# Altium schematic sheet 1_MCU.schdoc (part 1 of 2)
size 426 x 304 mm; Symbol: Sheet-Symbol_A3; Device: Sheet-Symbol_A3; Convert to PCB: yes; Add into BOM: yes; Part Number: JLCPCB-001; Drawed: FXC; Reviewed: FXC; Company: 深圳嘉立创科技发展有限公司; @Project Name: 3D打印机控制板 SKR MINI E3V2_精简版; @Page Count: 1; @Update Date: 2022-07-12; @Create Date: 2022-01-04; @Schematic Name: SKR MINI E3V2 SCH; Version: V0.1; Page Size: A3; @Page No: 1
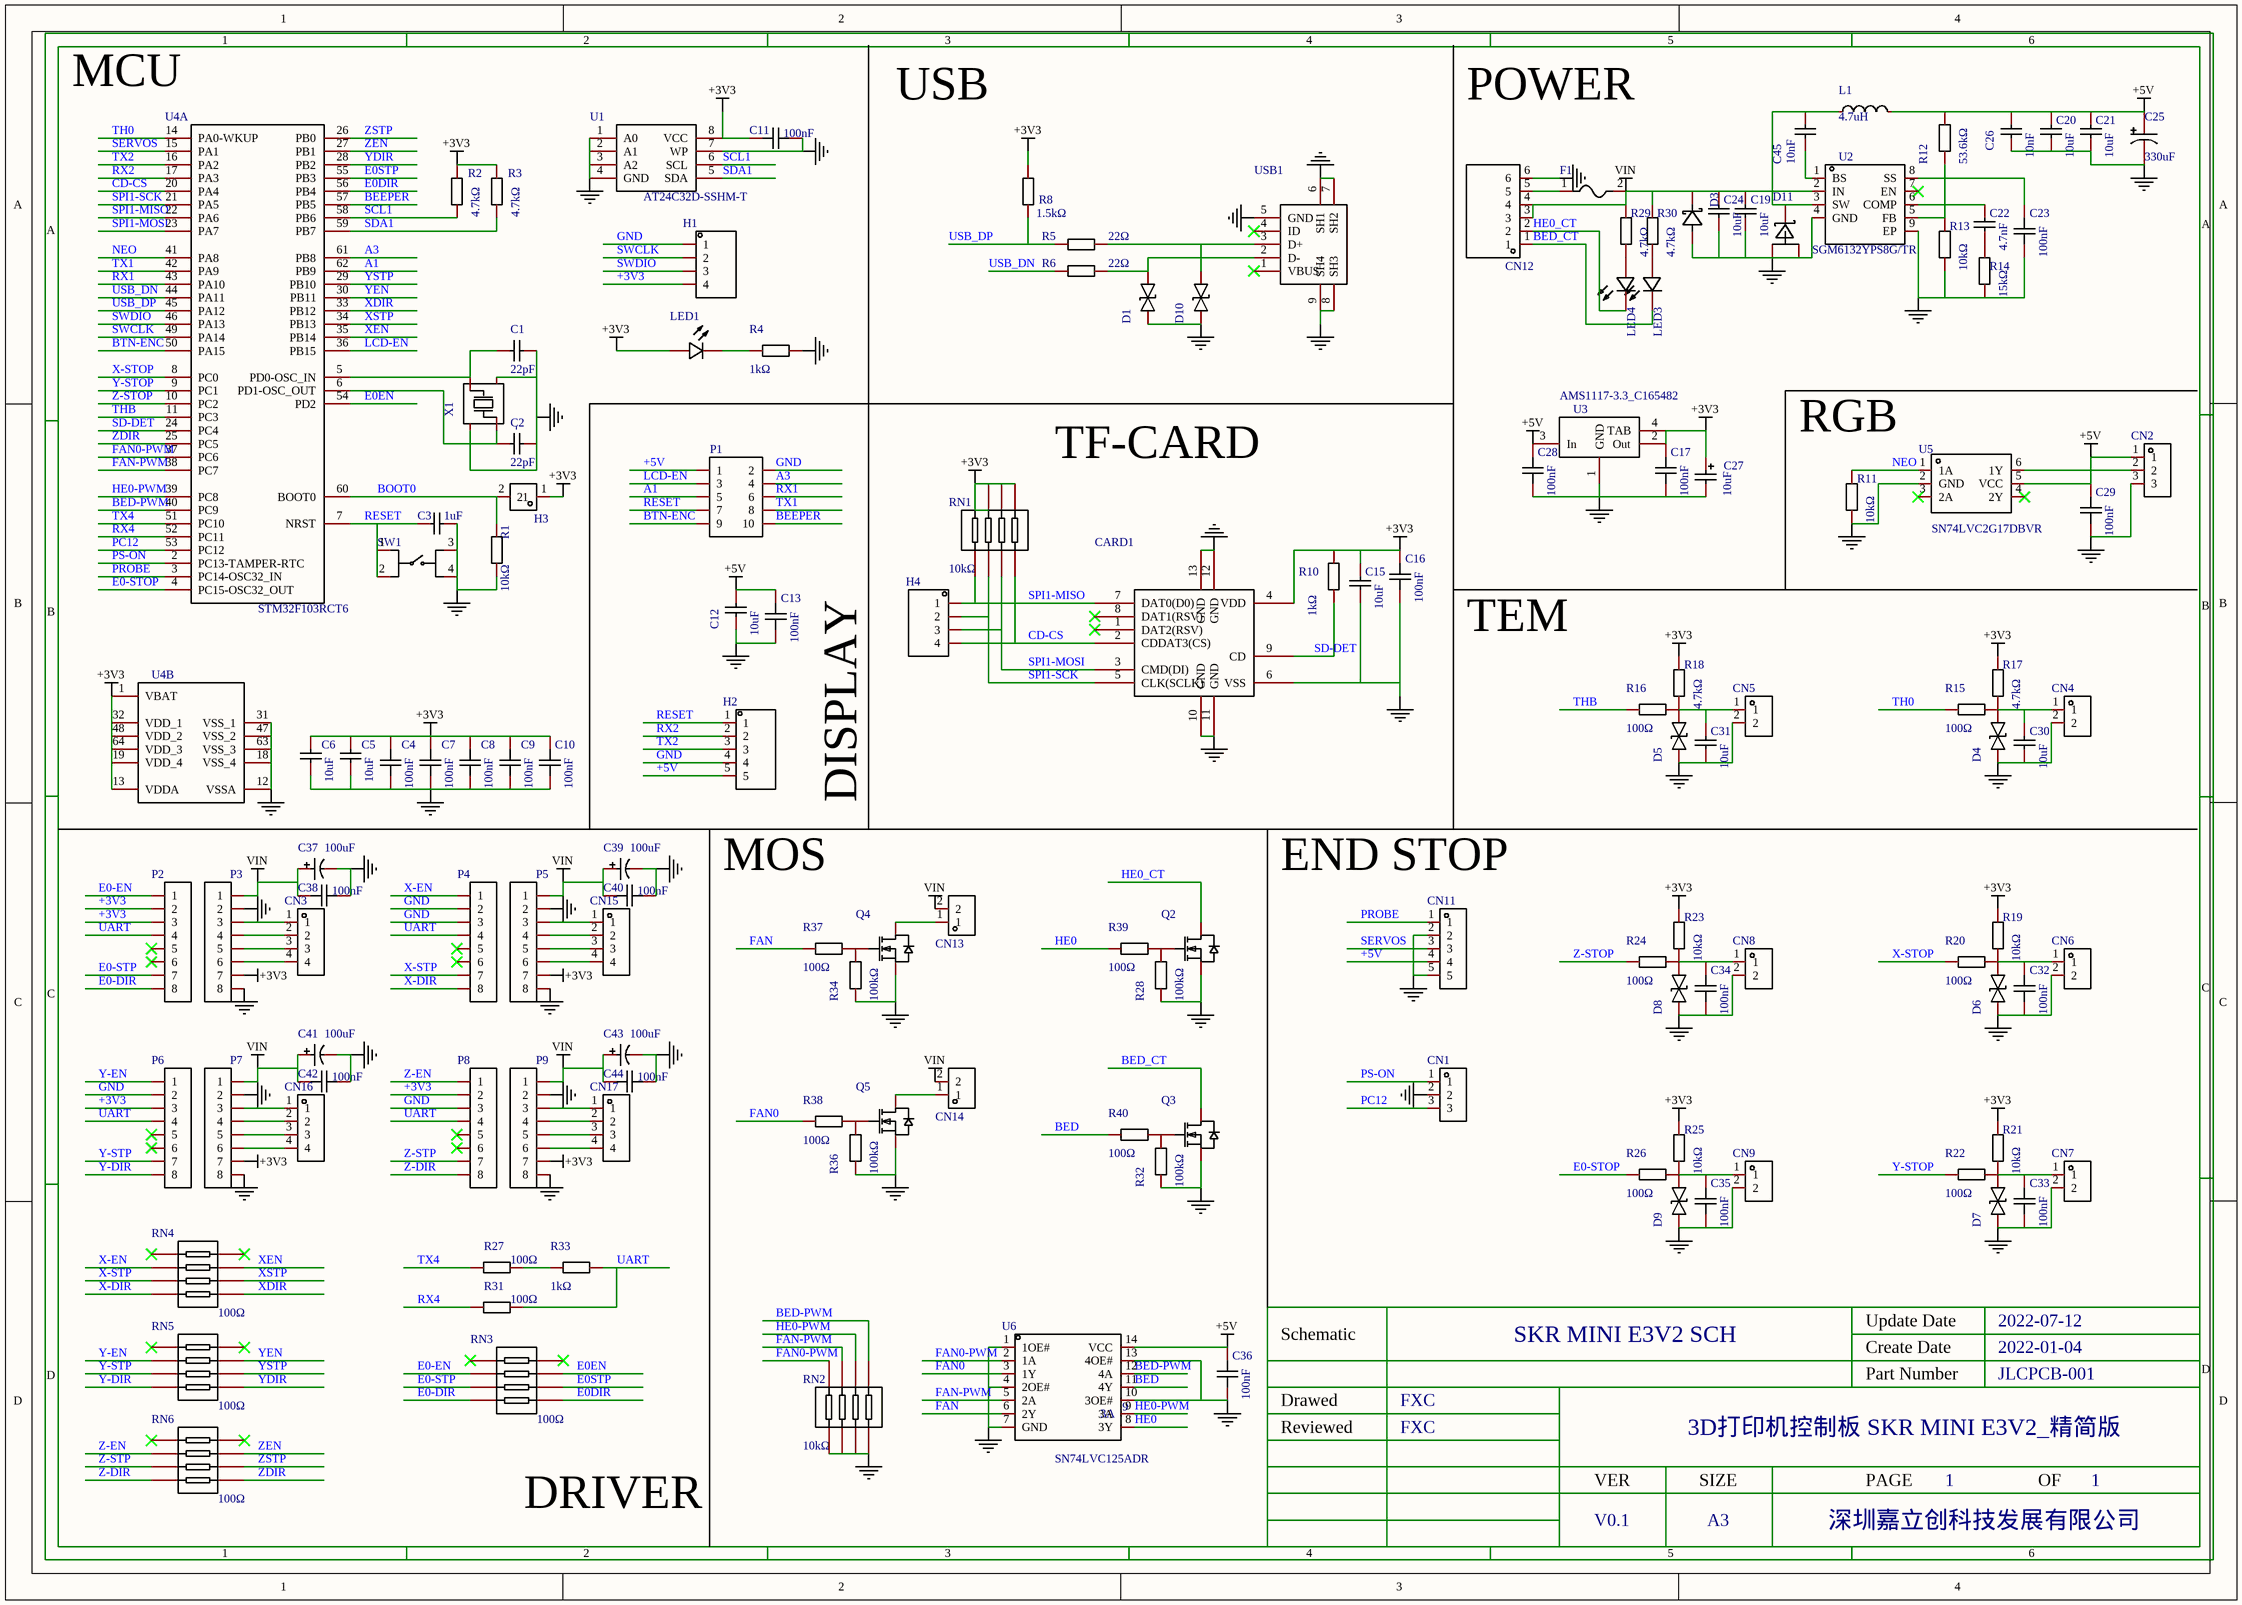
[diagram p0: 1_MCU.schdoc]

## Parts
C1  value 22pF  [C0603]  (hidden comment: CC0603JRNPO9BN220)
C2  value 22pF  [C0603]  (hidden comment: CC0603JRNPO9BN220)
C3  value 1uF  [C0603]  (hidden comment: CC0603KRX5R8BB105)
C4  value 100nF  [C0603]  (hidden comment: CC0603KRX7R9BB104)
C5  value 10uF  [C0603]  (hidden comment: 0603X106K160NT)
C6  value 10uF  [C0603]  (hidden comment: 0603X106K160NT)
C7  value 100nF  [C0603]  (hidden comment: CC0603KRX7R9BB104)
C8  value 100nF  [C0603]  (hidden comment: CC0603KRX7R9BB104)
C9  value 100nF  [C0603]  (hidden comment: CC0603KRX7R9BB104)
C10  value 100nF  [C0603]  (hidden comment: CC0603KRX7R9BB104)
C11  value 100nF  [C0603]  (hidden comment: CC0603KRX7R9BB104)
C12  value 10uF  [C0603]  (hidden comment: 0603X106K160NT)
C13  value 100nF  [C0603]  (hidden comment: CC0603KRX7R9BB104)
C15  value 10uF  [C0603]  (hidden comment: 0603X106K160NT)
C16  value 100nF  [C0603]  (hidden comment: CC0603KRX7R9BB104)
C17  value 100nF  [C0603]  (hidden comment: CC0603KRX7R9BB104)
C19  value 10uF  [C1210]  (hidden comment: GRM32ER71H106KA12L)
C20  value 10uF  [C1210]  (hidden comment: GRM32ER71H106KA12L)
C21  value 10uF  [C1210]  (hidden comment: GRM32ER71H106KA12L)
C22  value 4.7nF  [C0603]  (hidden comment: CC0603KRX7R9BB472)
C23  value 100nF  [C0603]  (hidden comment: CC0603KRX7R9BB104)
C24  value 10uF  [C1210]  (hidden comment: GRM32ER71H106KA12L)
C25  value 330uF  [CAP-SMD_BD8.0-L8.3-W8.3-FD]  (hidden comment: VEJ331M1ETR-0810)
C26  value 10nF  [C0603]  (hidden comment: CC0603KRX7R9BB103)
C27  value 10uF  [CAP-SMD_L3.2-W2.8]  (hidden comment: TAJB106K016RNJ)
C28  value 100nF  [C0603]  (hidden comment: CC0603KRX7R9BB104)
C29  value 100nF  [C0603]  (hidden comment: CC0603KRX7R9BB104)
C30  value 10uF  [C0603]  (hidden comment: 0603X106K160NT)
C31  value 10uF  [C0603]  (hidden comment: 0603X106K160NT)
C32  value 100nF  [C0603]  (hidden comment: CC0603KRX7R9BB104)
C33  value 100nF  [C0603]  (hidden comment: CC0603KRX7R9BB104)
C34  value 100nF  [C0603]  (hidden comment: CC0603KRX7R9BB104)
C35  value 100nF  [C0603]  (hidden comment: CC0603KRX7R9BB104)
C36  value 100nF  [C0603]  (hidden comment: CC0603KRX7R9BB104)
C37  value 100uF  [CAP-SMD_BD6.3-L6.6-W6.6-FD]  (hidden comment: DV101M035E077ETR)
C38  value 100nF  [C0603]  (hidden comment: CC0603KRX7R9BB104)
C39  value 100uF  [CAP-SMD_BD6.3-L6.6-W6.6-FD]  (hidden comment: DV101M035E077ETR)
C40  value 100nF  [C0603]  (hidden comment: CC0603KRX7R9BB104)
C41  value 100uF  [CAP-SMD_BD6.3-L6.6-W6.6-FD]  (hidden comment: DV101M035E077ETR)
C42  value 100nF  [C0603]  (hidden comment: CC0603KRX7R9BB104)
C43  value 100uF  [CAP-SMD_BD6.3-L6.6-W6.6-FD]  (hidden comment: DV101M035E077ETR)
C44  value 100nF  [C0603]  (hidden comment: CC0603KRX7R9BB104)
C45  value 10nF  [C0603]  (hidden comment: CC0603KRX7R9BB103)
CARD1  TF-01A  [TF-SMD_TF-01A]  (value not drawn)
CN1  HX25003-3A  [CONN-TH_3P-P2.50_HX25003-3A]  (value not drawn)
CN2  HX25003-3A  [CONN-TH_3P-P2.50_HX25003-3A]  (value not drawn)
CN3  HX25003-4A  [CONN-TH_4P-P2.50_HX25003-4A]  (value not drawn)
CN4  HX25003-2A  [CONN-TH_2P-P2.50_HX25003-2A]  (value not drawn)
CN5  HX25003-2A  [CONN-TH_2P-P2.50_HX25003-2A]  (value not drawn)
CN6  HX25003-2A  [CONN-TH_2P-P2.50_HX25003-2A]  (value not drawn)
CN7  HX25003-2A  [CONN-TH_2P-P2.50_HX25003-2A]  (value not drawn)
CN8  HX25003-2A  [CONN-TH_2P-P2.50_HX25003-2A]  (value not drawn)
CN9  HX25003-2A  [CONN-TH_2P-P2.50_HX25003-2A]  (value not drawn)
CN11  HX25003-5A  [CONN-TH_5P-P2.50_HX25003-5A]  (value not drawn)
CN12  HB9500M-9.5-6P  [CONN-TH_6P-P9.50_HB9500-9.5-6P]  (value not drawn)
CN13  HX25003-2A  [CONN-TH_2P-P2.50_HX25003-2A]  (value not drawn)
CN14  HX25003-2A  [CONN-TH_2P-P2.50_HX25003-2A]  (value not drawn)
CN15  HX25003-4A  [CONN-TH_4P-P2.50_HX25003-4A]  (value not drawn)
CN16  HX25003-4A  [CONN-TH_4P-P2.50_HX25003-4A]  (value not drawn)
CN17  HX25003-4A  [CONN-TH_4P-P2.50_HX25003-4A]  (value not drawn)
D1  0402ESDA-05N  [D0402]  (value not drawn)
D3  SMCJ24A_C699044  [SMC_L6.9-W5.9-LS7.9-R-RD]  (value not drawn)
D4  0402ESDA-05N  [D0402]  (value not drawn)
D5  0402ESDA-05N  [D0402]  (value not drawn)
D6  0402ESDA-05N  [D0402]  (value not drawn)
D7  0402ESDA-05N  [D0402]  (value not drawn)
D8  0402ESDA-05N  [D0402]  (value not drawn)
D9  0402ESDA-05N  [D0402]  (value not drawn)
D10  0402ESDA-05N  [D0402]  (value not drawn)
D11  SVM1045V  [TO-277B_3P-L6.1-W4.3-LS6.5-BR]  (value not drawn)
F1  JFC2410-1800TS  [F2410]  (value not drawn)
H1  B-2100S04P-A110  [HDR-TH_4P-P2.54-V-M]  (value not drawn)
H2  B-2100S05P-A110  [HDR-TH_5P-P2.54-V-M]  (value not drawn)
H3  PH-00218  [HDR-TH_P2.54-V-M-R1-C2-S2.54]  (value not drawn)
H4  B-2100S04P-A110  [HDR-TH_4P-P2.54-V-M]  (value not drawn)
L1  value 4.7uH  [IND-SMD_L6.0-W6.0_SLF6028T]  (hidden comment: SLO0630H100MTT)
LED1  19-217/GHC-YR1S2/3T  [LED0603-R-RD]  (value not drawn)
LED3  19-213/R6W-BP2Q2B/3T  [LED0603-R-RD]  (value not drawn)
LED4  19-213/R6W-BP2Q2B/3T  [LED0603-R-RD]  (value not drawn)
P1  2.54-2*5P简牛  [IDC-TH_10P-P2.54_C5665]  (value not drawn)
P2  2.54-1*8P母环保  [HDR-TH_8P-P2.54-V-F-1]  (value not drawn)
P3  2.54-1*8P母环保  [HDR-TH_8P-P2.54-V-F-1]  (value not drawn)
P4  2.54-1*8P母环保  [HDR-TH_8P-P2.54-V-F-1]  (value not drawn)
P5  2.54-1*8P母环保  [HDR-TH_8P-P2.54-V-F-1]  (value not drawn)
P6  2.54-1*8P母环保  [HDR-TH_8P-P2.54-V-F-1]  (value not drawn)
P7  2.54-1*8P母环保  [HDR-TH_8P-P2.54-V-F-1]  (value not drawn)
P8  2.54-1*8P母环保  [HDR-TH_8P-P2.54-V-F-1]  (value not drawn)
P9  2.54-1*8P母环保  [HDR-TH_8P-P2.54-V-F-1]  (value not drawn)
Q2  NCE6050KA  [TO-252-2_L6.6-W6.1-P4.57-LS9.9-TL-CW]  (value not drawn)
Q3  NCE6050KA  [TO-252-2_L6.6-W6.1-P4.57-LS9.9-TL-CW]  (value not drawn)
Q4  AO3400A_C20917  [SOT-23-3_L2.9-W1.6-P1.90-LS2.8-BR]  (value not drawn)
Q5  AO3400A_C20917  [SOT-23-3_L2.9-W1.6-P1.90-LS2.8-BR]  (value not drawn)
R1  value 10kΩ  [R0603]  (hidden comment: RC0603FR-0710KL)
R2  value 4.7kΩ  [R0603]  (hidden comment: RC0603FR-074K7L)
R3  value 4.7kΩ  [R0603]  (hidden comment: RC0603FR-074K7L)
R4  value 1kΩ  [R0603]  (hidden comment: RC0603FR-071KL)
R5  value 22Ω  [R0603]  (hidden comment: RC0603FR-0722RL)
R6  value 22Ω  [R0603]  (hidden comment: RC0603FR-0722RL)
R8  value 1.5kΩ  [R0603]  (hidden comment: 0603WAF1501T5E)
R10  value 1kΩ  [R0603]  (hidden comment: RC0603FR-071KL)
R11  value 10kΩ  [R0603]  (hidden comment: RC0603FR-0710KL)
R12  value 53.6kΩ  [R0603]  (hidden comment: 0603WAF5362T5E)
R13  value 10kΩ  [R0603]  (hidden comment: RC0603FR-0710KL)
R14  value 15kΩ  [R0603]  (hidden comment: AC0603FR-0715KL)
R15  value 100Ω  [R0603]  (hidden comment: RC0603FR-07100RL)
R16  value 100Ω  [R0603]  (hidden comment: RC0603FR-07100RL)
R17  value 4.7kΩ  [R0603]  (hidden comment: RC0603FR-074K7L)
R18  value 4.7kΩ  [R0603]  (hidden comment: RC0603FR-074K7L)
R19  value 10kΩ  [R0603]  (hidden comment: RC0603FR-0710KL)
R20  value 100Ω  [R0603]  (hidden comment: RC0603FR-07100RL)
R21  value 10kΩ  [R0603]  (hidden comment: RC0603FR-0710KL)
R22  value 100Ω  [R0603]  (hidden comment: RC0603FR-07100RL)
R23  value 10kΩ  [R0603]  (hidden comment: RC0603FR-0710KL)
R24  value 100Ω  [R0603]  (hidden comment: RC0603FR-07100RL)
R25  value 10kΩ  [R0603]  (hidden comment: RC0603FR-0710KL)
R26  value 100Ω  [R0603]  (hidden comment: RC0603FR-07100RL)
R27  value 100Ω  [R0603]  (hidden comment: RC0603FR-07100RL)
R28  value 100kΩ  [R0603]  (hidden comment: RC0603FR-07100KL)
R29  value 4.7kΩ  [R0603]  (hidden comment: RC0603FR-074K7L)
R30  value 4.7kΩ  [R0603]  (hidden comment: RC0603FR-074K7L)
R31  value 100Ω  [R0603]  (hidden comment: RC0603FR-07100RL)
R32  value 100kΩ  [R0603]  (hidden comment: RC0603FR-07100KL)
R33  value 1kΩ  [R0603]  (hidden comment: RC0603FR-071KL)
R34  value 100kΩ  [R0603]  (hidden comment: RC0603FR-07100KL)
R36  value 100kΩ  [R0603]  (hidden comment: RC0603FR-07100KL)
R37  value 100Ω  [R0603]  (hidden comment: RC0603FR-07100RL)
R38  value 100Ω  [R0603]  (hidden comment: RC0603FR-07100RL)
R39  value 100Ω  [R0603]  (hidden comment: RC0603FR-07100RL)
R40  value 100Ω  [R0603]  (hidden comment: RC0603FR-07100RL)
RN1  value 10kΩ  [RES-ARRAY-SMD_0603-8P-L3.2-W1.6-BL]  (hidden comment: YC164-JR-0710KL)
RN2  value 10kΩ  [RES-ARRAY-SMD_0603-8P-L3.2-W1.6-BL]  (hidden comment: YC164-JR-0710KL)
RN3  value 100Ω  [RES-ARRAY-SMD_0603-8P-L3.2-W1.6-BL]  (hidden comment: 4D03WGJ0101T5E)
RN4  value 100Ω  [RES-ARRAY-SMD_0603-8P-L3.2-W1.6-BL]  (hidden comment: 4D03WGJ0101T5E)
RN5  value 100Ω  [RES-ARRAY-SMD_0603-8P-L3.2-W1.6-BL]  (hidden comment: 4D03WGJ0101T5E)
RN6  value 100Ω  [RES-ARRAY-SMD_0603-8P-L3.2-W1.6-BL]  (hidden comment: 4D03WGJ0101T5E)
SW1  K2-6639SP-C4SC-04  [KEY-SMD_4P-L6.0-W6.0-P3.90-LS10.0]  (value not drawn)
U1  AT24C32D-SSHM-T  [SOIC-8_L5.0-W4.0-P1.27-LS6.0-BL]
U2  SGM6132YPS8G/TR  [SOIC-8_L4.9-W3.9-P1.27-LS6.0-BL-EP3.4]
U3  Symbol: AMS1117-3.3_C165482  [SOT-223_L6.5-W3.5-P2.30-LS7.0-BR]  (hidden comment: SK1117-3.3)
U4  STM32F103RCT6  [LQFP-64_L10.0-W10.0-P0.50-LS12.0-BL]  (parts A,B of 2)
U5  SN74LVC2G17DBVR  [SOT-23-6_L2.9-W1.6-P0.95-LS2.8-BR]
U6  NAME: 3A  NUMBER: 9  [SOIC-14_L8.7-W3.9-P1.27-LS6.0-BL]  (hidden comment: SN74LVC125ADR)
USB1  MicroXNJ  [MICRO-USB-SMD_MICROXNJ]  (value not drawn)
X1  TAXM8M4RDBCCT2T  [OSC-SMD_4P-L3.2-W2.5-BL]  (value not drawn)

## Nets
+3V3: C4.2 C5.2 C6.2 C7.2 C8.2 C9.2 C10.2 C11.2 C15.2 C16.2 C17.2 C27.1 CARD1.4(VDD) H1.4 H3.1 LED1.1(A) P2.2 P2.3 P3.7 P5.7 P6.3 P7.7 P8.2 P9.7 R2.2 R3.2 R8.2 R10.2 R17.2 R18.2 R19.2 R21.2 R23.2 R25.2 RN1.5 RN1.6 RN1.7 RN1.8 U1.8(VCC) U3.2(Out) U3.4(TAB) U4.1(VBAT) U4.13(VDDA) U4.19(VDD_4) U4.32(VDD_1) U4.48(VDD_2) U4.64(VDD_3)
+5V: C12.2 C13.2 C20.2 C21.2 C25.1 C26.2 C28.2 C29.2 C36.2 CN2.1 CN11.4 H2.5 L1.2 P1.1 R12.2 U3.3(In) U5.5(VCC) U6.14(VCC)
GND: C1.2 C2.2 C3.2 C4.1 C5.1 C6.1 C7.1 C8.1 C9.1 C10.1 C11.1 C12.1 C13.1 C15.1 C16.1 C17.1 C19.1 C20.1 C21.1 C23.1 C24.1 C25.2 C26.1 C27.2 C28.1 C29.1 C30.1 C31.1 C32.1 C33.1 C34.1 C35.1 C36.1 C37.2 C38.1 C39.2 C40.1 C41.2 C42.1 C43.2 C44.1 CARD1.6(VSS) CARD1.10(GND) CARD1.11(GND) CARD1.12(GND) CARD1.13(GND) CN1.2 CN2.3 CN4.2 CN5.2 CN6.2 CN7.2 CN8.2 CN9.2 CN11.2 CN11.5 CN12.6 D1.1 D3.1(A) D4.1 D5.1 D6.1 D7.1 D8.1 D9.1 D10.1 D11.1(A) D11.2(A) H1.1 H2.4 P1.2 P3.2 P3.8 P4.2 P4.3 P5.2 P5.8 P6.2 P7.2 P7.8 P8.3 P9.2 P9.8 Q2.3(S) Q3.3(S) Q4.2(S) Q5.2(S) R1.2 R4.2 R11.1 R13.1 R14.1 R28.1 R32.1 R34.1 R36.1 RN2.1 RN2.2 RN2.3 RN2.4 SW1.3 SW1.4 U1.1(A0) U1.2(A1) U1.3(A2) U1.4(GND) U1.7(WP) U2.4(GND) U2.9(EP) U3.1(GND) U4.12(VSSA) U4.18(VSS_4) U4.31(VSS_1) U4.47(VSS_2) U4.63(VSS_3) U5.2(GND) U6.1(1OE#) U6.4(2OE#) U6.7(GND) U6.10(3OE#) U6.13(4OE#) USB1.5(GND) USB1.6(SH1) USB1.7(SH2) USB1.8(SH3) USB1.9(SH4) X1.2 X1.4
VIN: C19.2 C24.2 C37.1 C38.2 C39.1 C40.2 C41.1 C42.2 C43.1 C44.2 CN12.3 CN12.4 CN13.2 CN14.2 D3.2(K) F1.2 P3.1 P5.1 P7.1 P9.1 R29.2 R30.2 U2.2(IN)
A1: P1.5 U4.62(PB9)
A3: P1.4 U4.61(PB8)
BED: R40.1 U6.11(4Y)
BED-PWM: RN2.5 U4.40(PC9) U6.12(4A)
BED_CT: CN12.1 LED3.2 Q3.2(D)
BEEPER: P1.10 U4.57(PB5)
BOOT0: H3.2 R1.1 U4.60(BOOT0)
BTN-ENC: P1.9 U4.50(PA15)
CD-CS: CARD1.2(CDDAT3(CS)) H4.4 RN1.4 U4.20(PA4)
E0-DIR: P2.8 RN3.4
E0-EN: P2.1 RN3.2
E0-STOP: R26.1 U4.4(PC15-OSC32_OUT)
E0-STP: P2.7 RN3.3
E0DIR: RN3.5 U4.56(PB4)
E0EN: RN3.7 U4.54(PD2)
E0STP: RN3.6 U4.55(PB3)
FAN: R37.1 U6.6(2Y)
FAN0: R38.1 U6.3(1Y)
FAN0-PWM: RN2.8 U4.37(PC6) U6.2(1A)
FAN-PWM: RN2.7 U4.38(PC7) U6.5(2A)
HE0: R39.1 U6.8(3Y)
HE0-PWM: RN2.6 U4.39(PC8) U6.9(3A)
HE0_CT: CN12.2 LED4.2 Q2.2(D)
LCD-EN: P1.3 U4.36(PB15)
NEO: R11.2 U4.41(PA8) U5.1(1A)
PC12: CN1.3 U4.53(PC12)
PROBE: CN11.1 U4.3(PC14-OSC32_IN)
PS-ON: CN1.1 U4.2(PC13-TAMPER-RTC)
RESET: C3.1 H2.1 P1.7 SW1.1 SW1.2 U4.7(NRST)
RX1: P1.6 U4.43(PA10)
RX2: H2.2 U4.17(PA3)
RX4: R31.1 U4.52(PC11)
SCL1: R2.1 U1.6(SCL) U4.58(PB6)
SD-DET: CARD1.9(CD) R10.1 U4.24(PC4)
SDA1: R3.1 U1.5(SDA) U4.59(PB7)
SERVOS: CN11.3 U4.15(PA1)
SPI1-MISO: CARD1.7(DAT0(D0)) H4.1 RN1.1 U4.22(PA6)
SPI1-MOSI: CARD1.3(CMD(DI)) H4.3 RN1.3 U4.23(PA7)
SPI1-SCK: CARD1.5(CLK(SCLK)) H4.2 RN1.2 U4.21(PA5)
SWCLK: H1.2 U4.49(PA14)
SWDIO: H1.3 U4.46(PA13)
TH0: R15.1 U4.14(PA0-WKUP)
THB: R16.1 U4.11(PC3)
TX1: P1.8 U4.42(PA9)
TX2: H2.3 U4.16(PA2)
TX4: R27.1 U4.51(PC10)
UART: P2.4 P4.4 P6.4 P8.4 R31.2 R33.2
USB_DN: R6.1 U4.44(PA11)
USB_DP: R5.1 R8.1 U4.45(PA12)
X-DIR: P4.8 RN4.4
X-EN: P4.1 RN4.2
X-STOP: R20.1 U4.8(PC0)
X-STP: P4.7 RN4.3
XDIR: RN4.5 U4.33(PB12)
XEN: RN4.7 U4.35(PB14)
XSTP: RN4.6 U4.34(PB13)
Y-DIR: P6.8 RN5.4
Y-EN: P6.1 RN5.2
Y-STOP: R22.1 U4.9(PC1)
Y-STP: P6.7 RN5.3
YDIR: RN5.5 U4.28(PB2)
YEN: RN5.7 U4.30(PB11)
YSTP: RN5.6 U4.29(PB10)
Z-DIR: P8.8 RN6.4
Z-EN: P8.1 RN6.2
Z-STOP: R24.1 U4.10(PC2)
Z-STP: P8.7 RN6.3
ZDIR: RN6.5 U4.25(PC5)
ZEN: RN6.7 U4.27(PB1)
ZSTP: RN6.6 U4.26(PB0)
NetC1_1: C1.1 U4.5(PD0-OSC_IN) X1.3
NetC2_1: C2.1 U4.6(PD1-OSC_OUT) X1.1
NetC22_1: C22.1 R14.2
NetC22_2: C22.2 U2.6(COMP)
NetC23_2: C23.2 U2.8(SS)
NetC30_2: C30.2 CN4.1 D4.2 R15.2 R17.1
NetC31_2: C31.2 CN5.1 D5.2 R16.2 R18.1
NetC32_2: C32.2 CN6.1 D6.2 R19.1 R20.2
NetC33_2: C33.2 CN7.1 D7.2 R21.1 R22.2
NetC34_2: C34.2 CN8.1 D8.2 R23.1 R24.2
NetC35_2: C35.2 CN9.1 D9.2 R25.1 R26.2
NetC45_1: C45.1 U2.1(BS)
NetC45_2: C45.2 D11.3(K) L1.1 U2.3(SW)
NetCN2_2: CN2.2 U5.6(1Y)
NetCN3_1: CN3.1 P3.3
NetCN3_2: CN3.2 P3.4
NetCN3_3: CN3.3 P3.5
NetCN3_4: CN3.4 P3.6
NetCN12_5: CN12.5 F1.1
NetCN13_1: CN13.1 Q4.3(D)
NetCN14_1: CN14.1 Q5.3(D)
NetCN15_1: CN15.1 P5.3
NetCN15_2: CN15.2 P5.4
NetCN15_3: CN15.3 P5.5
NetCN15_4: CN15.4 P5.6
NetCN16_1: CN16.1 P7.3
NetCN16_2: CN16.2 P7.4
NetCN16_3: CN16.3 P7.5
NetCN16_4: CN16.4 P7.6
NetCN17_1: CN17.1 P9.3
NetCN17_2: CN17.2 P9.4
NetCN17_3: CN17.3 P9.5
NetCN17_4: CN17.4 P9.6
NetD1_2: D1.2 R6.2 USB1.2(D-)
NetD10_2: D10.2 R5.2 USB1.3(D+)
NetLED1_2: LED1.2(C) R4.1
NetLED3_1: LED3.1 R30.1
NetLED4_1: LED4.1 R29.1
NetQ2_1: Q2.1(G) R28.2 R39.2
NetQ3_1: Q3.1(G) R32.2 R40.2
NetQ4_1: Q4.1(G) R34.2 R37.2
NetQ5_1: Q5.1(G) R36.2 R38.2
NetR12_1: R12.1 R13.2 U2.5(FB)
NetR27_2: R27.2 R33.1

Not connected (* = marked no-connect by the designer): CARD1 1(DAT2(RSV))* 8(DAT1(RSV))*; P2 5* 6*; P4 5* 6*; P6 5* 6*; P8 5* 6*; RN3 1* 8*; RN4 1* 8*; RN5 1* 8*; RN6 1* 8*; U2 7(EN)*; U5 3(2A)* 4(2Y)*; USB1 1(VBUS)* 4(ID)*

## Notes on the sheet
- MCU
- USB
- POWER
- TF-CARD
- (near R11) RGB
- TEM
- (near C13) DISPLAY
- MOS
- (near CN11) END STOP
- DRIVER
- 1
- 2
- 3
- 4
- 5
- 6
- A
- B
- C
- Schematic
- SKR MINI E3V2 SCH
- Create Date
- Update Date
- 2022-07-12
- 2022-01-04
- D
- Reviewed
- Drawed
- FXC
- Part Number
- 3D打印机控制板 SKR MINI E3V2_精简版
- JLCPCB-001
- VER
- SIZE
- PAGE
- OF
- V0.1
- A3
- 深圳嘉立创科技发展有限公司